# Altium project GB-Drone_master_aux.PrjPcb
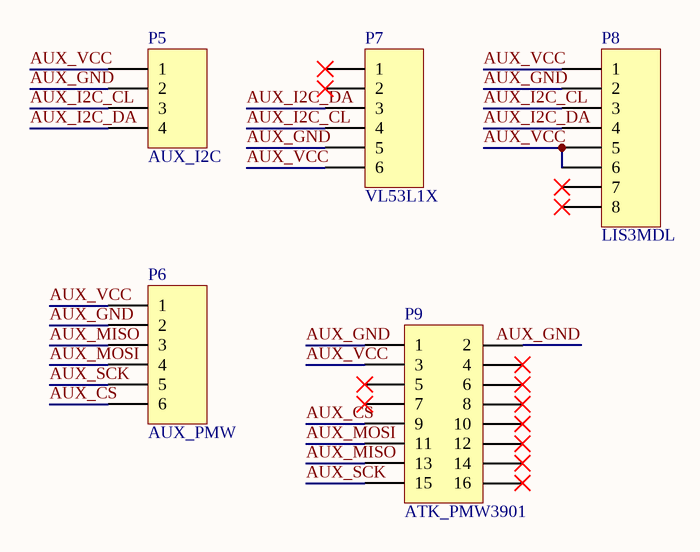
[diagram p0: Sheet3.SchDoc]
1 sheet, 5 parts. Net scope: global (net labels, ports and power ports of the same name join across sheets).
Board file: PCB2.PcbDoc

## Sheet Sheet3.SchDoc
size A4; SheetNumber: 1; SheetTotal: 1

### Parts
P5  AUX_I2C  [XH2.54-4P]
P6  AUX_PMW  [XH2.54-6P]
P7  VL53L1X  [HDR1X6]
P8  LIS3MDL  [HDR1X8]
P9  ATK_PMW3901  [ATK-PMW3901]

### Nets
AUX_CS: P6.6 P9.9
AUX_GND: P5.2 P6.2 P7.5 P8.2 P9.1 P9.2
AUX_I2C_CL: P5.3 P7.4 P8.3
AUX_I2C_DA: P5.4 P7.3 P8.4
AUX_MISO: P6.3 P9.13
AUX_MOSI: P6.4 P9.11
AUX_SCK: P6.5 P9.15
AUX_VCC: P5.1 P6.1 P7.6 P8.1 P8.5 P8.6 P9.3

Not connected (* = marked no-connect by the designer): P7 1* 2*; P8 7* 8*; P9 4* 5* 6* 7* 8* 10* 12* 14* 16*

### Library data of the parts
P5 = Header 4: Header, 4-Pin; LatestRevisionDate: 17-Jul-2002; LatestRevisionNote: Re-released for DXP Platform.; Publisher: Altium Limited
P6 P7 = Header 6: Header, 6-Pin; LatestRevisionDate: 17-Jul-2002; LatestRevisionNote: Re-released for DXP Platform.; Publisher: Altium Limited
P8 = Header 8: Header, 8-Pin; LatestRevisionDate: 17-Jul-2002; LatestRevisionNote: Re-released for DXP Platform.; Publisher: Altium Limited
P9 = Header 8X2: Header, 8-Pin, Dual row; LatestRevisionDate: 17-Jul-2002; LatestRevisionNote: Re-released for DXP Platform.; Publisher: Altium Limited